# EAGLE design mavroOBD-Power (EAGLE 7.5.0)
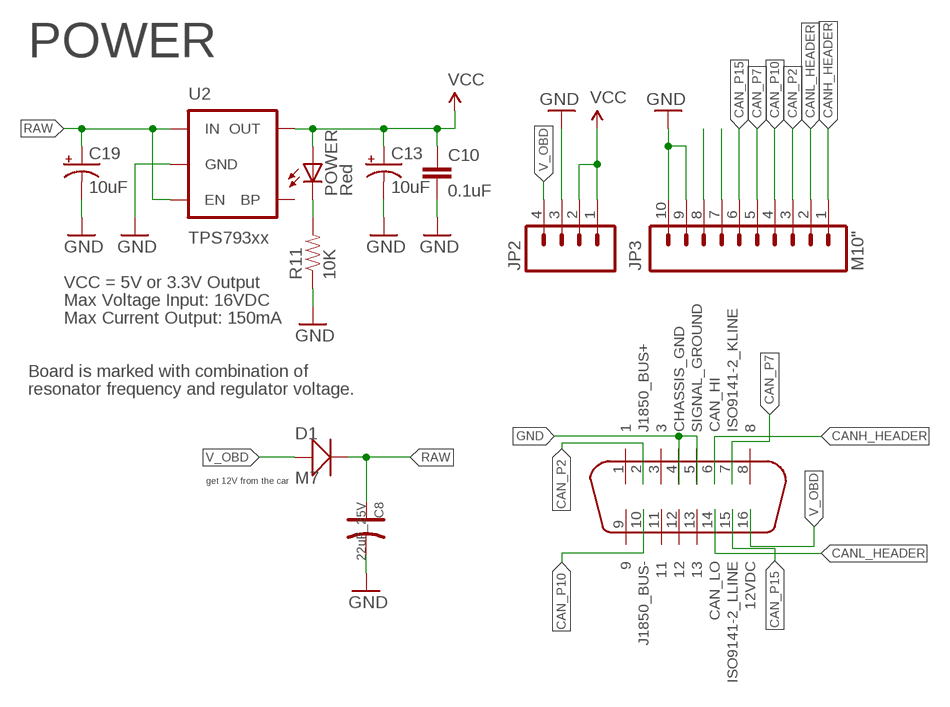
[diagram p0: schematic, sheet 1]

## Parts
C8  22uF_25V  CAP-ELECTRO-B  [ELECTRO-SMD-B-4.8MM]
C10  0.1uF  CAP0603-CAP  [0603-CAP]
C13  10uF  CAP_POL1206  [EIA3216]
C19  10uF  CAP_POL1206  [EIA3216]
D1  M7  D-SMA  [D2010]
JP2  M04PTH  [1X04]
JP3  M10"  [1X10]
POWER  Red  LED  [0603-LED-ALT1]
R11  10K  RESISTOR0603-RES  [0603-RES]
U2  TPS793xx  V_REG_LDOSMD  [SOT23-5]
U$1  ODBII-CON  [OBDII-CON]

## Nets
CAN_P2: JP3.3 U$1.2(J1850_BUS+)
CAN_P7: JP3.5 U$1.7(ISO9141-2_KLINE)
CAN_P10: JP3.4 U$1.10(J1850_BUS-)
CAN_P15: JP3.6 U$1.15(ISO9141-2_LLINE)
CANH_HEADER: JP3.1 U$1.6(CAN_HI)
CANL_HEADER: JP3.2 U$1.14(CAN_LO)
GND [power]: C8.- C10.2 C13.C(-) C19.C(-) JP2.3 JP3.9 JP3.10 R11.1 U2.2(GND) U$1.4(CHASSIS_GND) U$1.5(SIGNAL_GROUND)
N$4: POWER.C R11.2
N$13: JP3.7
N$14: JP3.8
RAW [power]: C8.+ C19.A(+) D1.- U2.1(IN) U2.3(EN)
V_OBD: D1.+ JP2.4 U$1.16(12VDC)
VCC_MAIN: C10.1 C13.A(+) JP2.1 JP2.2 POWER.A U2.5(OUT) ; supply symbol labelled VCC
Unconnected: U2.4(BP) U$1.1 U$1.3 U$1.8 U$1.9 U$1.11 U$1.12 U$1.13

## Notes on the sheet
- POWER
- VCC = 5V or 3.3V Output
- Max Voltage Input: 16VDC
- Max Current Output: 150mA
- Board is marked with combination of
- resonator frequency and regulator voltage.
- get 12V from the car

## Library data of the parts
C8 = Discrete:CAP*: Electrolytic Capacitors,Tantalum Capacitors and Super Capacitors
C10 = SparkFun:CAP: Capacitor Standard 0603 ceramic capacitor, and 0.1" leaded capacitor.
C13 C19 = SparkFun:CAP_POL: Capacitor Polarized These are standard SMD and PTH capacitors. Normally 10uF, 47uF, and 100uF in electrolytic and tantalum varieties. Always verify the external diameter of the through hole cap, it varies with capacity, voltage, and manufacturer. The EIA devices should be standard.
D1 = Discrete:D*
JP2 = SparkFun-Connectors:M04: Header 4 Standard 4-pin 0.1" header. Use with straight break away headers (SKU : PRT-00116), right angle break away headers (PRT-00553), swiss pins (PRT-00743), machine pins (PRT-00117), and female headers (PRT-00115). Molex polarized connector foot print use with SKU : PRT-08231 with associated crimp pins and housings. 1MM SMD Version SKU: PRT-10208
JP3 = SparkFun-Connectors:M10: Header 10 Standard 10-pin 0.1" header. Use with straight break away headers (SKU : PRT-00116), right angle break away headers (PRT-00553), swiss pins (PRT-00743), machine pins (PRT-00117), and female headers (PRT-00115).
POWER = Testing:LED: LEDs Standard schematic elements and footprints for 5mm, 3mm, 1206, and 0603 sized LEDs. 5mm - Spark Fun Electronics SKU : COM-00529 (and others)
R11 = SparkFun:RESISTOR: Resistor Basic schematic elements and footprints for 0603, 1206, and PTH resistors.
U2 = SparkFun:V_REG_LDO: Voltage Regulator LDO Standard 150mA LDO voltage regulator in SOT-23 layout. Micrel part MIC5205. BP (by-pass) pin is used to lower output noise with 470pF cap.
U$1 = myrocontrol:ODBII-CON

## Net classes
0 default: width 0.254 mm, drill 0.406 mm, clearance 0.355 mm
1 power: width 0.254 mm, drill 0.711 mm, clearance 0.355 mm to class 0, clearance 0.355 mm
2 gnd: width 0.254 mm, drill 0.711 mm, clearance 0.355 mm to class 0, clearance 0.355 mm to class 1, clearance 0.355 mm

## Board
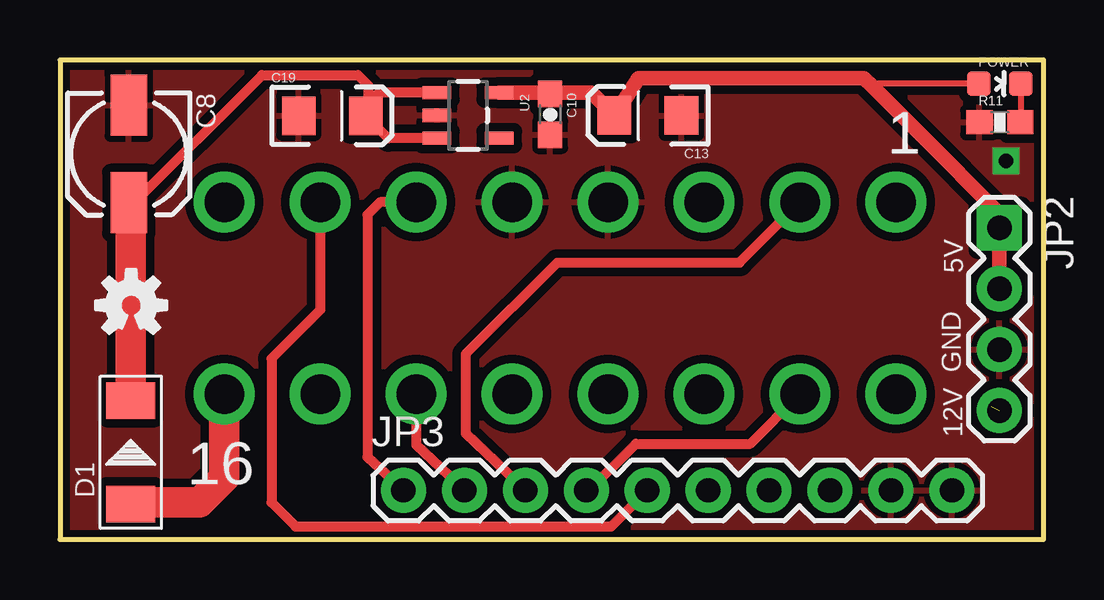
[diagram p1: board, top side]
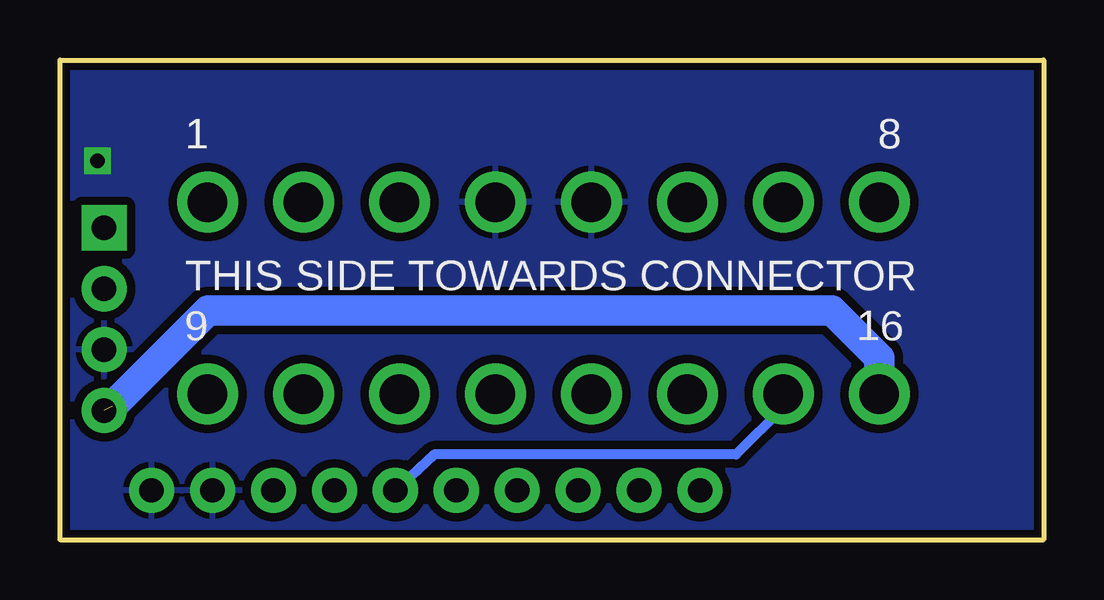
[diagram p2: board, bottom side, seen from below]

Size 41 x 20 mm. Coordinates in mm from the lower left corner, seen from the top.
Outline: 0,20 0,0 41,0 41,20 0,20
Copper layers (1*16): Top 0.035mm / dielectric 1.5mm / Bottom 0.035mm
Design rules "SparkFun-2-layer *": minimum track width 7mil, minimum drill 15mil, track to track 8mil, track to pad 8mil, pad to pad 8mil, via to via 8mil, smd to smd 8mil, copper to edge 8mil, drill to drill 8mil, minimum pad ring 12mil, minimum via ring 10mil, stop-mask expansion 4mil, vias tented up to drill 20mil, thermal gap 10mil

### Footprints (pad centres in the part's own frame; a part is rotated, then mirrored left to right if it is on the bottom)
ELECTRO-SMD-B-4.8MM = smd 2.54 x 1.524: + 2.032,0; - -2.032,0
0603-CAP = smd 1.1 x 1: 1 -0.85,0; 2 0.85,0
EIA3216 = smd 1.4 x 1.6: A 1.4,0; C -1.4,0
D2010 = smd 1.524 x 2.032: + -2.159,0; - 2.159,0
1X04 = drill 1.016 pad 1.88 square: 1 0,0 | drill 1.016 pad 1.88: 2 2.54,0; 3 5.08,0; 4 7.62,0
1X10 = drill 1.016 pad 1.88: 1 0,0; 2 2.54,0; 3 5.08,0; 4 7.62,0; 5 10.16,0; 6 12.7,0; 7 15.24,0; 8 17.78,0; 9 20.32,0; 10 22.86,0
0603-LED-ALT1 = smd 1 x 1: A 0,-0.877; C 0,0.877
0603-RES = smd 1.1 x 1: 1 -0.85,0; 2 0.85,0
SOT23-5 = smd 0.55 x 1.2: 1 -0.95,-1.3; 2 0,-1.3; 3 0.95,-1.3; 4 0.95,1.3; 5 -0.95,1.3
OBDII-CON = drill 1.65 pad 2.54: 1 -14.54,3.81; 2 -10.54,3.81; 3 -6.54,3.81; 4 -2.54,3.81; 5 1.46,3.81; 6 5.46,3.81; 7 9.46,3.81; 8 13.46,3.81; 9 -14.54,-4.19; 10 -10.54,-4.19; 11 -6.54,-4.19; 12 -2.54,-4.19; 13 1.46,-4.19; 14 5.46,-4.19; 15 9.46,-4.19; 16 13.46,-4.19

### Placement (x,y rotation side)
C8  2.87,16.08 270 top
C10  20.43,17.73 270 top
C13  24.5,17.68 180 top
C19  11.35,17.67 0 top
D1  2.95,3.64 90 top
JP2  39.16,13 270 top
JP3  14.32,2.05 0 top
POWER  39.18,19.01 270 top
R11  39.18,17.4 0 top
U2  17.01,17.69 270 top
U$1  20.31,10.26 0 bottom
U$2  OSHW-LOGOS  [OSHW-LOGO-S]  2.97,9.77 0 top

### Tracks (layer width: path | path; a pad name or v marks a point on that pad's centre or on a via)
CAN_P2
  Top 0.406: JP3.3 16.91,4.42 16.91,7.73 20.73,11.55 28.33,11.55 U$1.2
CAN_P7
  Top 0.406: U$1.7 10.85,9.58 8.82,7.55 8.82,1.55 9.82,0.55 22.98,0.55 JP3.5
CAN_P10
  Top 0.406: JP3.4 21.94,1.94 24,4 28.78,4 U$1.10
CAN_P15
  Bottom 0.406: U$1.15 10.85,5.52 12.82,3.55 25.4,3.55 JP3.6
CANH_HEADER
  Top 0.406: U$1.6 13.34,14.07 12.82,13.55 12.82,3.43 JP3.1
CANL_HEADER
  Top 0.406: U$1.14 14.85,3.94 JP3.2
GND  (via drill 0.6)
  other vias: 39.43,15.79
  pour Top (isolate 0.305): 0,20 41,20 41,0 0,0
  pour Bottom (isolate 0.305): 0,20 41,20 41,0 0,0
N$4
  Top 0.254: POWER.C 40.05,17.42 R11.2
RAW
  Top 0.406: 12.85,18.2 12.85,18.94 12.42,19.37 8.42,19.37 2.95,13.9 2.95,13.68 | 12.85,18.2 12.85,17.77 C19.A 13.68,16.74 U2.3 | U2.1 13.29,18.64 12.85,18.2
  Top 1.27: D1.- 2.95,13.68 C8.+
V_OBD  (1 unrouted)
  Top 1.27: U$1.16 6.85,2.58 5.82,1.55 3.02,1.55 D1.+
  Bottom 1.27: U$1.16 6.85,7.58 8.82,9.55 34.82,9.55 38.82,5.55
VCC_MAIN
  Top 0.254: POWER.A 34.01,19.01 33.88,18.88
  Top 0.61: U2.5 20.37,18.64 | 20.37,18.64 C10.1 | 20.37,18.64 22.15,18.64 C13.A 24.11,19.24 33.51,19.24 33.88,18.88 35.88,16.88 39.16,13.6 JP2.1 JP2.2

### Text on the board
tPlace: 1 | 5V | GND | 12V | 16
tValues: Valid combinations: | 168V / 3.3V Reg / 8MHz | 168 / 5V Reg / 16MHz | 168 / 5V Reg / 20MHz | Mark back accordingly | Arduino Pro Mini